# Altium project STM32.PrjPcb
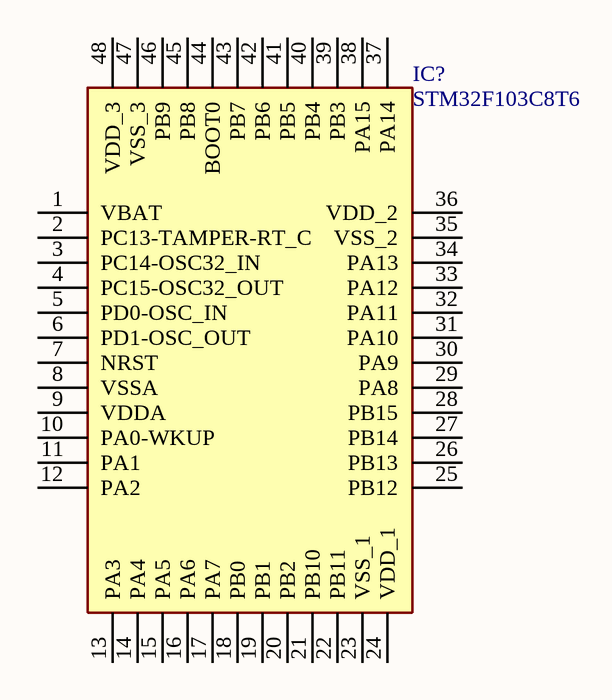
[diagram p0: STM32.SchDoc]
1 sheet, 1 parts. Net scope: global (net labels, ports and power ports of the same name join across sheets).
Board file: STM32.PcbDoc

## Sheet STM32.SchDoc
size A4; SheetNumber: 1; SheetTotal: 1

### Parts
IC?  STM32F103C8T6  [QFPN48]

### Nets

Not connected (* = marked no-connect by the designer): IC? 1(VBAT) 2(PC13-TAMPER-RT_C) 3(PC14-OSC32_IN) 4(PC15-OSC32_OUT) 5(PD0-OSC_IN) 6(PD1-OSC_OUT) 7(NRST) 8(VSSA) 9(VDDA) 10(PA0-WKUP) 11(PA1) 12(PA2) 13(PA3) 14(PA4) 15(PA5) 16(PA6) 17(PA7) 18(PB0) 19(PB1) 20(PB2) 21(PB10) 22(PB11) 23(VSS_1) 24(VDD_1) 25(PB12) 26(PB13) 27(PB14) 28(PB15) 29(PA8) 30(PA9) 31(PA10) 32(PA11) 33(PA12) 34(PA13) 35(VSS_2) 36(VDD_2) 37(PA14) 38(PA15) 39(PB3) 40(PB4) 41(PB5) 42(PB6) 43(PB7) 44(BOOT0) 45(PB8) 46(PB9) 47(VSS_3) 48(VDD_3)

### Library data of the parts
IC? = STM32F103C8T6: Integrated Circuit; Manufacturer_Name: STMicroelectronics; Datasheet Link: https://www.st.com/resource/en/datasheet/stm32f103c8.pdf; Height: 1.6mm; Manufacturer_Part_Number: STM32F103C8T6; Mouser Part Number: 511-STM32F103C8T6; Mouser Price/Stock: https://www.mouser.co.uk/ProductDetail/STMicroelectronics/STM32F103C8T6?qs=bhCVus9SdFtq6kqxsU5%2FDA%3D%3D; Arrow Part Number: STM32F103C8T6; Arrow Price/Stock: https://www.arrow.com/en/products/stm32f103c8t6/stmicroelectronics?utm_currency=USD&region=nac